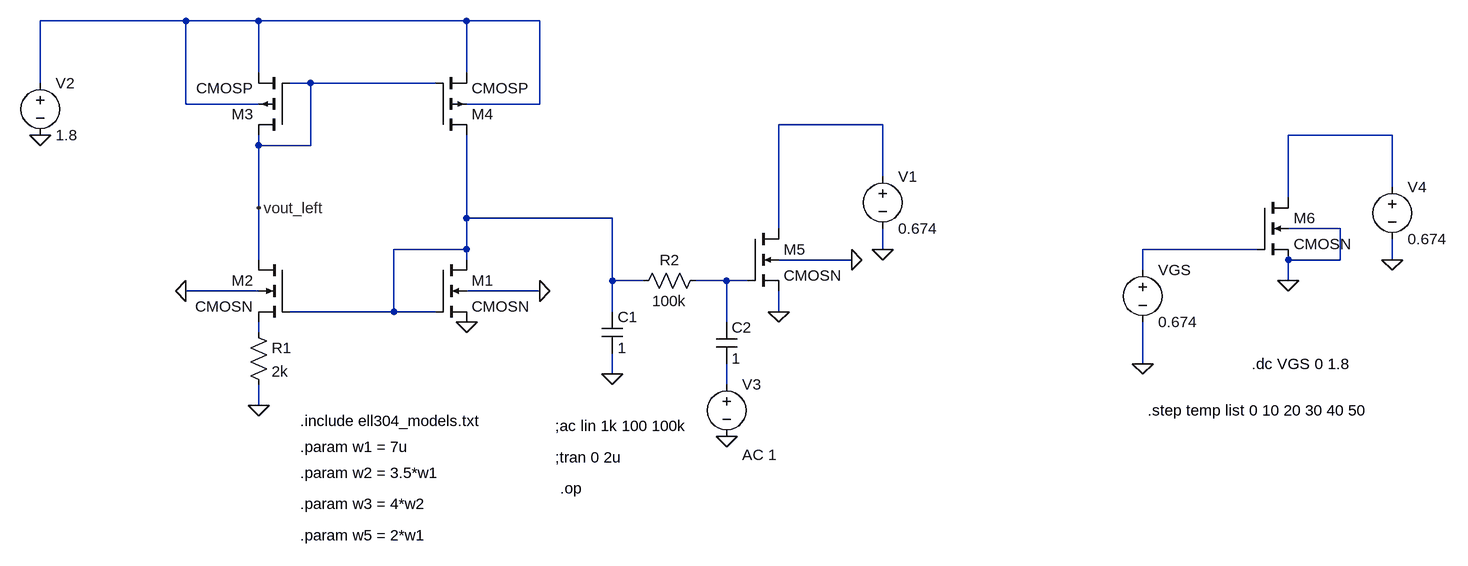
[diagram p0: schematic exmp8.asc]
exmp8.asc, the LTspice schematic file:
Version 4
SHEET 1 1756 680
WIRE -192 -208 -416 -208
WIRE -80 -208 -192 -208
WIRE 240 -208 -80 -208
WIRE 352 -208 240 -208
WIRE -80 -128 -80 -208
WIRE 240 -128 240 -208
WIRE -416 -112 -416 -208
WIRE 0 -112 -32 -112
WIRE 192 -112 0 -112
WIRE -192 -80 -192 -208
WIRE -80 -80 -192 -80
WIRE 352 -80 352 -208
WIRE 352 -80 240 -80
WIRE 880 -48 720 -48
WIRE 1664 -32 1504 -32
WIRE -80 -16 -80 -32
WIRE 0 -16 0 -112
WIRE 0 -16 -80 -16
WIRE 880 32 880 -48
WIRE 1664 48 1664 -32
WIRE 1504 64 1504 -32
WIRE -80 80 -80 -16
WIRE 240 96 240 -32
WIRE 464 96 240 96
WIRE 720 112 720 -48
WIRE 1584 112 1504 112
WIRE 240 144 240 96
WIRE 240 144 128 144
WIRE 880 144 880 112
WIRE 1456 144 1280 144
WIRE -80 160 -80 80
WIRE 240 160 240 144
WIRE 832 160 720 160
WIRE 1584 160 1584 112
WIRE 1584 160 1504 160
WIRE 1664 160 1664 128
WIRE 1280 176 1280 144
WIRE 464 192 464 96
WIRE 512 192 464 192
WIRE 640 192 592 192
WIRE 672 192 640 192
WIRE 1504 192 1504 160
WIRE -80 208 -192 208
WIRE 352 208 240 208
WIRE 128 240 128 144
WIRE 128 240 -32 240
WIRE 192 240 128 240
WIRE 464 240 464 192
WIRE 720 240 720 208
WIRE 640 256 640 192
WIRE -80 272 -80 256
WIRE 1280 320 1280 256
WIRE 464 336 464 304
WIRE 640 352 640 320
WIRE -80 384 -80 352
FLAG -192 208 0
FLAG 352 208 0
FLAG 240 256 0
FLAG -80 384 0
FLAG -416 -32 0
FLAG -80 80 vout_left
FLAG 464 336 0
FLAG 640 432 0
FLAG 880 144 0
FLAG 1280 320 0
FLAG 1504 192 0
FLAG 1664 160 0
FLAG 720 240 0
FLAG 832 160 0
SYMBOL nmos4 192 160 R0
SYMATTR InstName M1
SYMATTR Value CMOSN
SYMATTR Value2 l=0.18u w=w1
SYMBOL nmos4 -32 160 M0
SYMATTR InstName M2
SYMATTR Value CMOSN
SYMATTR Value2 l=0.18u w=w1
SYMBOL res -96 256 R0
SYMATTR InstName R1
SYMATTR Value 2k
SYMBOL pmos4 -32 -32 R180
SYMATTR InstName M3
SYMATTR Value CMOSP
SYMATTR Value2 l=0.18u w=w2
SYMBOL pmos4 192 -32 M180
SYMATTR InstName M4
SYMATTR Value CMOSP
SYMATTR Value2 l=0.18u w=w3
SYMBOL voltage -416 -128 R0
WINDOW 123 0 0 Left 0
WINDOW 39 0 0 Left 0
SYMATTR InstName V2
SYMATTR Value 1.8
SYMBOL res 608 176 R90
WINDOW 0 0 56 VBottom 2
WINDOW 3 32 56 VTop 2
SYMATTR InstName R2
SYMATTR Value 100k
SYMBOL cap 448 240 R0
SYMATTR InstName C1
SYMATTR Value 1
SYMBOL cap 624 256 R0
SYMATTR InstName C2
SYMATTR Value 1
SYMBOL voltage 640 336 R0
WINDOW 123 24 124 Left 2
WINDOW 39 0 0 Left 0
SYMATTR Value2 AC 1
SYMATTR InstName V3
SYMATTR Value ""
SYMBOL nmos4 672 112 R0
SYMATTR InstName M5
SYMATTR Value CMOSN
SYMATTR Value2 l=0.18u w=w5
SYMBOL voltage 880 16 R0
WINDOW 123 0 0 Left 0
WINDOW 39 0 0 Left 0
SYMATTR InstName V1
SYMATTR Value 0.674
SYMBOL voltage 1280 160 R0
WINDOW 123 0 0 Left 0
WINDOW 39 0 0 Left 0
SYMATTR InstName VGS
SYMATTR Value 0.674
SYMBOL nmos4 1456 64 R0
SYMATTR InstName M6
SYMATTR Value CMOSN
SYMATTR Value2 l=0.18u w=w1
SYMBOL voltage 1664 32 R0
WINDOW 123 0 0 Left 0
WINDOW 39 0 0 Left 0
SYMATTR InstName V4
SYMATTR Value 0.674
TEXT -16 408 Left 2 !.include ell304_models.txt
TEXT -16 448 Left 2 !.param w1 = 7u
TEXT -16 488 Left 2 !.param w2 = 3.5*w1
TEXT -16 536 Left 2 !.param w3 = 4*w2
TEXT -16 584 Left 2 !.param w5 = 2*w1
TEXT 1448 320 Left 2 !.dc VGS 0 1.8
TEXT 376 416 Left 2 !;ac lin 1k 100 100k
TEXT 376 464 Left 2 !;tran 0 2u
TEXT 384 512 Left 2 !.op
TEXT 1288 392 Left 2 !.step temp list 0 10 20 30 40 50

The netlist it stands for:
* exmp8.asc
M1 N004 N004 0 0 CMOSN l=0.18u w=w1
M2 vout_left N004 N007 0 CMOSN l=0.18u w=w1
R1 N007 0 2k
M3 vout_left vout_left N001 N001 CMOSP l=0.18u w=w2
M4 N004 vout_left N001 N001 CMOSP l=0.18u w=w3
V2 N001 0 1.8
R2 N006 N004 100k
C1 N004 0 1
C2 N006 N008 1
V3 N008 0 AC 1
M5 N002 N006 0 0 CMOSN l=0.18u w=w5
V1 N002 0 0.674
VGS N005 0 0.674
M6 N003 N005 0 0 CMOSN l=0.18u w=w1
V4 N003 0 0.674
.model NMOS NMOS
.model PMOS PMOS
.lib standard.mos
.include ell304_models.txt
.param w1 = 7u
.param w2 = 3.5*w1
.param w3 = 4*w2
.param w5 = 2*w1
.dc VGS 0 1.8
;ac lin 1k 100 100k
;tran 0 2u
.op
.step temp list 0 10 20 30 40 50
.backanno
.end